# Altium schematic sheet Stepper.SchDoc
size A; SheetNumber: 2; SheetTotal: 4
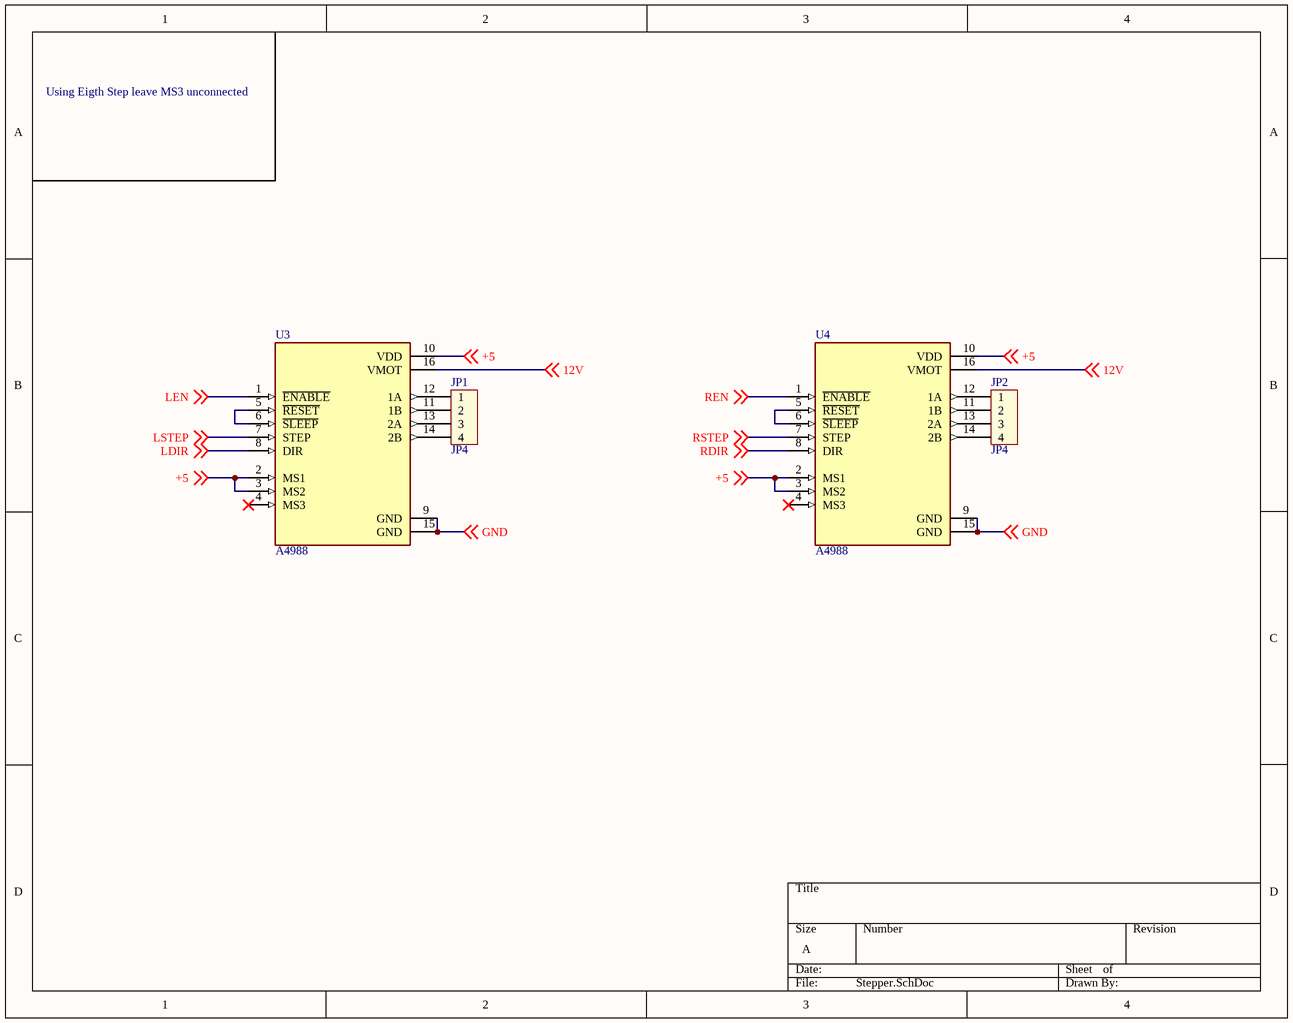
[diagram p0: Stepper.SchDoc]

## Parts
JP1  JP4  [CON4]
JP2  JP4  [CON4]
U3  A4988  [MODULE_A4988_STEPPER_MOTOR_DRIVER_CARRIER]
U4  A4988  [MODULE_A4988_STEPPER_MOTOR_DRIVER_CARRIER]

## Nets
12V: U3.16(VMOT) U4.16(VMOT) ; off-sheet 12V
+5: U3.2(MS1) U3.3(MS2) U3.10(VDD) U4.2(MS1) U4.3(MS2) U4.10(VDD) ; off-sheet +5
GND: U3.9(GND) U3.15(GND) U4.9(GND) U4.15(GND) ; off-sheet GND
LDIR: U3.8(DIR) ; off-sheet LDIR
LEN: U3.1(~{ENABLE}) ; off-sheet LEN
LSTEP: U3.7(STEP) ; off-sheet LSTEP
RDIR: U4.8(DIR) ; off-sheet RDIR
REN: U4.1(~{ENABLE}) ; off-sheet REN
RSTEP: U4.7(STEP) ; off-sheet RSTEP
NetJP1_1: JP1.1 U3.12(1A)
NetJP1_2: JP1.2 U3.11(1B)
NetJP1_3: JP1.3 U3.13(2A)
NetJP1_4: JP1.4 U3.14(2B)
NetJP2_1: JP2.1 U4.12(1A)
NetJP2_2: JP2.2 U4.11(1B)
NetJP2_3: JP2.3 U4.13(2A)
NetJP2_4: JP2.4 U4.14(2B)
NetU3_5: U3.5(~{RESET}) U3.6(~{SLEEP})
NetU4_5: U4.5(~{RESET}) U4.6(~{SLEEP})

Not connected (* = marked no-connect by the designer): U3 4(MS3)*; U4 4(MS3)*

## Notes on the sheet
- Using Eigth Step leave MS3 unconnected

## Library data of the parts
JP1 JP2 = Con4: Connector 4; Value: Connector 4
U3 U4 = A4988_STEPPER_MOTOR_DRIVER_CARRIER: Stepper motor controler; IC: A4988; 1A; Uin mot: 8Ã·35V; Price: None; Value: *; MP: A4988_STEPPER_MOTOR_DRIVER_CARRIER; Package: None; Availability: Unavailable